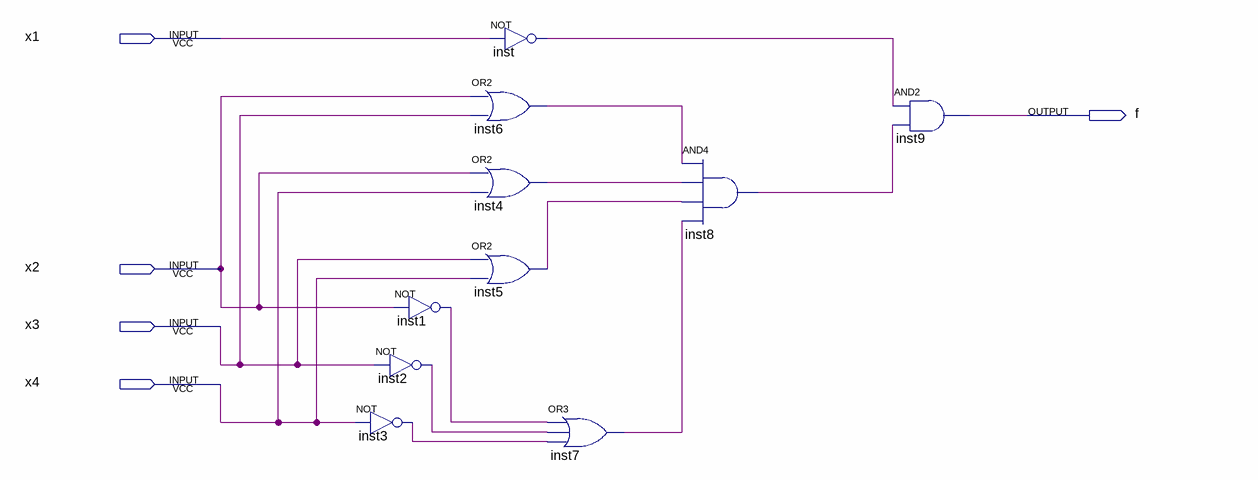
[diagram p0: schematic sheet]
// Quartus schematic Cirquit2.bdf as structural Verilog: 10 symbols, 5 pins
module Cirquit2 (
  input  x1,
  input  x2,
  input  x3,
  input  x4,
  output f
);

  wire inst1_out, inst2_out, inst3_out, inst4_out, inst5_out, inst6_out, inst7_out, inst8_out, inst_out;

  not inst3 (inst3_out, x4);
  not inst1 (inst1_out, x2);
  not inst2 (inst2_out, x3);
  not inst (inst_out, x1);
  or inst6 (inst6_out, x2, x3);
  or inst4 (inst4_out, x2, x4);
  or inst5 (inst5_out, x3, x4);
  or inst7 (inst7_out, inst1_out, inst2_out, inst3_out);
  and inst8 (inst8_out, inst6_out, inst4_out, inst5_out, inst7_out);
  and inst9 (f, inst_out, inst8_out);
endmodule
